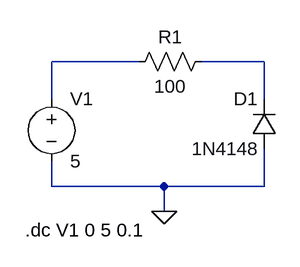
[diagram p0: schematic lab2_Reverse_Bias_2019A3PS0443H_VISHWAS_GAUTAM.asc]
lab2_Reverse_Bias_2019A3PS0443H_VISHWAS_GAUTAM.asc, the LTspice schematic file:
Version 4
SHEET 1 880 680
WIRE 144 -144 32 -144
WIRE 304 -144 224 -144
WIRE 32 -96 32 -144
WIRE 304 -96 304 -144
WIRE 32 16 32 -16
WIRE 176 16 32 16
WIRE 304 16 304 -32
WIRE 304 16 176 16
WIRE 176 48 176 16
FLAG 176 48 0
SYMBOL diode 320 -32 R180
WINDOW 0 24 64 Left 2
WINDOW 3 24 0 Left 2
SYMATTR InstName D1
SYMATTR Value 1N4148
SYMBOL voltage 32 -112 R0
WINDOW 123 0 0 Left 0
WINDOW 39 0 0 Left 0
SYMATTR InstName V1
SYMATTR Value 5
SYMBOL res 240 -160 R90
WINDOW 0 0 56 VBottom 2
WINDOW 3 32 56 VTop 2
SYMATTR InstName R1
SYMATTR Value 100
TEXT -2 72 Left 2 !.dc V1 0 5 0.1

The netlist it stands for:
* lab2_Reverse_Bias_2019A3PS0443H_VISHWAS_GAUTAM.asc
D1 0 N002 1N4148
V1 N001 0 5
R1 N002 N001 100
.model D D
.lib standard.dio
.dc V1 0 5 0.1
.backanno
.end